# Altium schematic sheet Sheet1.SchDoc: Init Title in DocParam
size A4; Organization: Use Organization_Name in ProjParam; Address1: Daniel Burnier; Address2: STI-IMT-LSRO1; Address3: EPFL; Address4: CH-1015 LAUSANNE; DocumentNumber: Init DocumentNumber in DocParam; Revision: A; SheetNumber: 1; SheetTotal: 1; ApprovedBy: Init ApprovedBy in DocParam; CheckedBy: Init CheckedBy in DocParam; Author: Init Author in DocParam; CompanyName: Init CompanyName in DocParam; DrawnBy: Init DrawBy in DocParam; Engineer: Init Engineer in DocParam; Title2: Init Title2 in DocParam; DocumentName: Init DocumentName in DocParam; ProjectName: Init ProjectName in DocParam
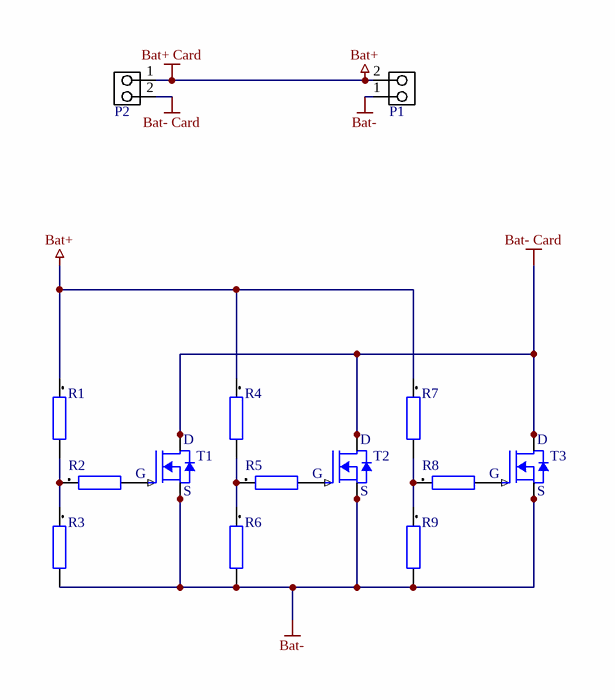
[diagram p0: Sheet1.SchDoc]

## Parts
P1  2 power pads  [PowerPads 2 pins]  (value not drawn)
P2  2 power pads  [PowerPads 2 pins]  (value not drawn)
R1  TBD  [RESC1608X06L]  (value not drawn)
R2  TBD  [RESC1608X06L]  (value not drawn)
R3  TBD  [RESC1608X06L]  (value not drawn)
R4  TBD  [RESC1608X06L]  (value not drawn)
R5  TBD  [RESC1608X06L]  (value not drawn)
R6  TBD  [RESC1608X06L]  (value not drawn)
R7  TBD  [RESC1608X06L]  (value not drawn)
R8  TBD  [RESC1608X06L]  (value not drawn)
R9  TBD  [RESC1608X06L]  (value not drawn)
T1  FDMC8010DC  [PQFN8 3.3X3.3]  (value not drawn)
T2  FDMC8010DC  [PQFN8 3.3X3.3]  (value not drawn)
T3  FDMC8010DC  [PQFN8 3.3X3.3]  (value not drawn)

## Nets
Bat+: P1.2 P2.1 R1.1 R4.1 R7.1  [also labelled Bat+ Card]
Bat-: P1.1 R3.2 R6.2 R9.2 T1.1(S) T1.2(S) T1.3(S) T2.1(S) T2.2(S) T2.3(S) T3.1(S) T3.2(S) T3.3(S)
Bat- Card: P2.2 T1.5(D) T1.6(D) T1.7(D) T1.8(D) T1.9(D) T2.5(D) T2.6(D) T2.7(D) T2.8(D) T2.9(D) T3.5(D) T3.6(D) T3.7(D) T3.8(D) T3.9(D)
NetR1_2: R1.2 R2.1 R3.1
NetR2_2: R2.2 T1.4(G)
NetR4_2: R4.2 R5.1 R6.1
NetR5_2: R5.2 T2.4(G)
NetR7_2: R7.2 R8.1 R9.1
NetR8_2: R8.2 T3.4(G)

## Notes on the sheet
- Date:
- Project
- Part
- Revision:
- File :
- Page
- de

## Library data of the parts
P1 P2 = 2 power pads: 2-Pin; Manufacturer: Generic Components; Class I: Connector; Revision: July-2002: Re-released for DXP Platform.; Publisher: Altium Limited
R1-R9 = TBD[[/\]]0603[[/\]]1: Resistor ToDo 0603; Preference: 1; Currentie: CHF; Size: 0603; Footprint Acort: 0603; ROHS: True; DateLastUpdate: 2012-11-19 / 14:13:33
T1-T3 = FDMC8010DC: Manufacturer: ON Semiconductor / Fairchild; Element Configuration: Dual; Supplier 1: Digi-Key; Manufacturer Part Number: FDMC8010DC; Stock 1: 36; Pricing 1: 1 = 1,29000, 10 = 1,15600, 100 = 0,90120, 500 = 0,74448, 1000 = 0,58774 (USD); RoHS: No; Mount: Surface Mount; Weight: 0.039g; Min Operating Temperature: -55°C; Max Operating Temperature: 150°C; Supplier Part Number 1: FDMC8010DCOSCT-ND